# EAGLE design temp_sensor_rev1 (EAGLE 6.5.0)
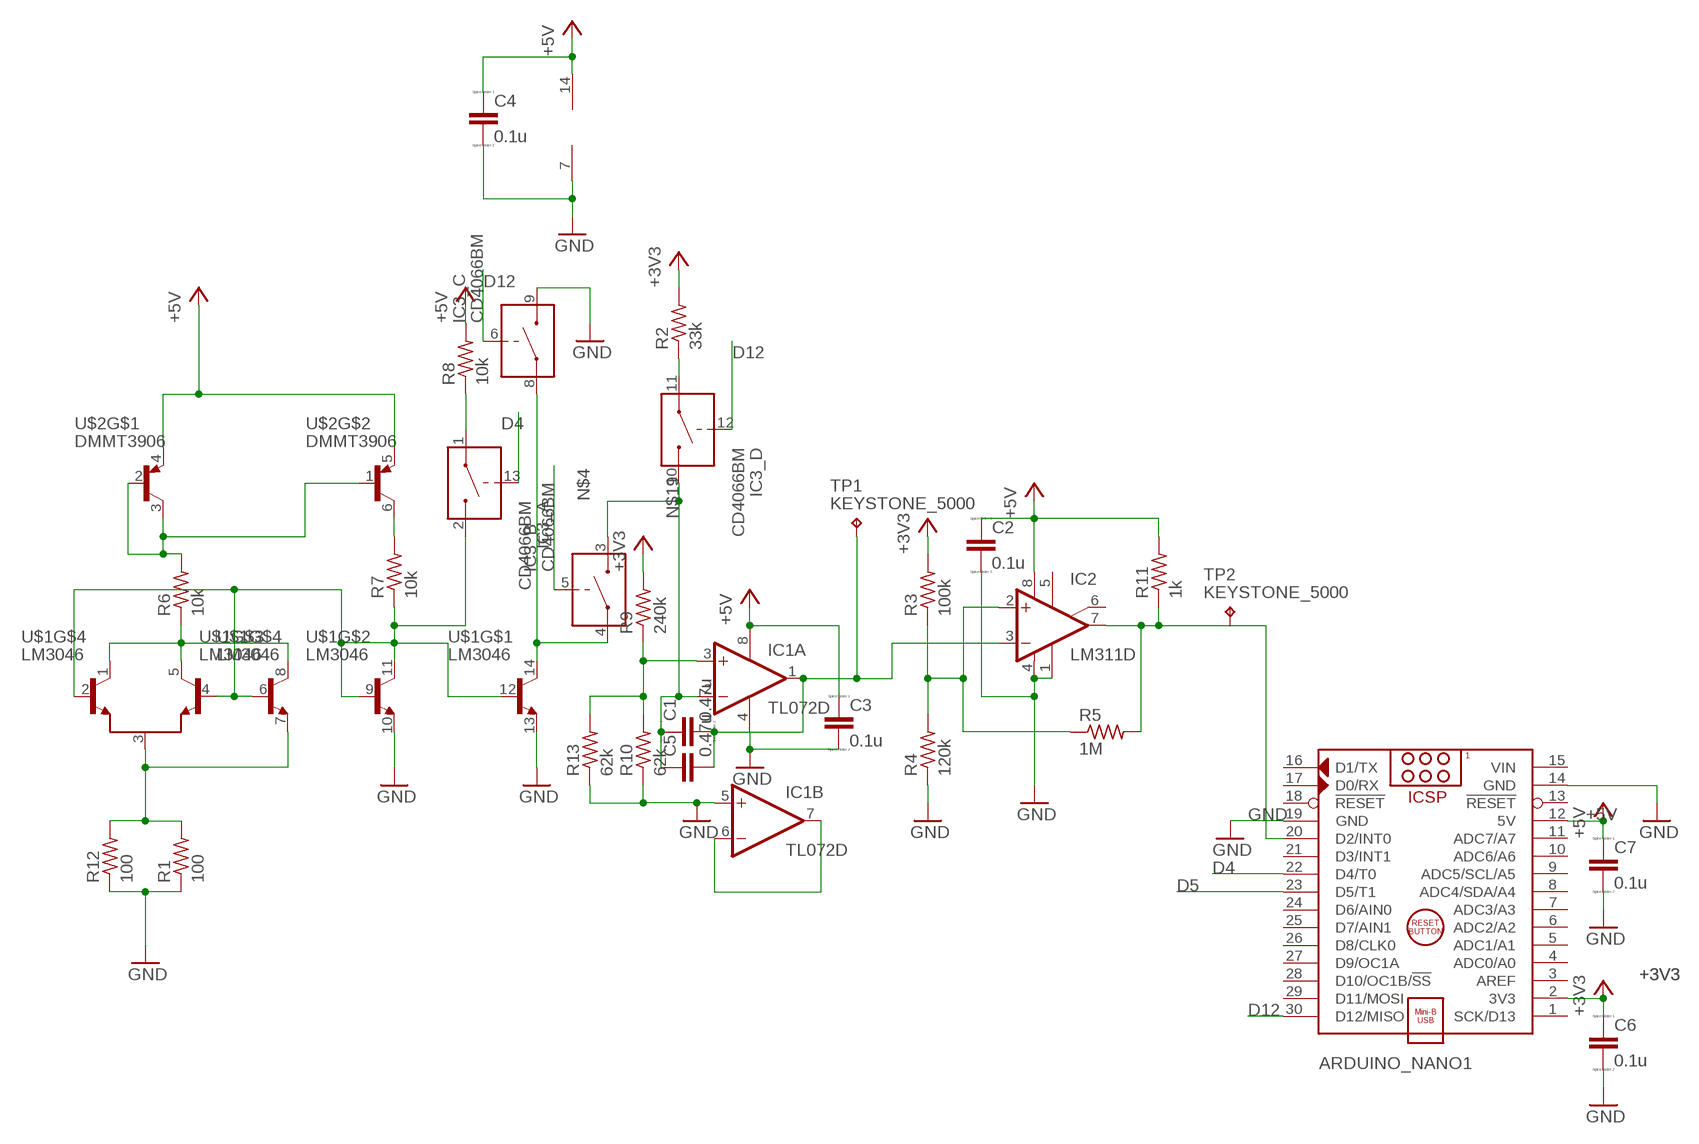
[diagram p0: schematic, sheet 1]

## Parts
ARDUINO_NANO1  ARDUINO_NANO  [ARDUINO_NANO]
C1  0.47u  CC1206  [C1206]
C2  0.1u  C  [C0805]
C3  0.1u  C  [C0805]
C4  0.1u  C  [C0805]
C5  0.47u  C2.5/2  [C2.5-2]
C6  0.1u  C  [C0805]
C7  0.1u  C  [C0805]
IC1  TL072D  [SO08]
IC2  LM311D  [SO08]
IC3  CD4066BM  [SO14]
R1  100  R-US_M1206  [M1206]
R2  33k  R-US_M1206  [M1206]
R3  100k  R-US_M1206  [M1206]
R4  120k  R-US_M1206  [M1206]
R5  1M  R-US_M1206  [M1206]
R6  10k  R-US_M1206  [M1206]
R7  10k  R-US_M1206  [M1206]
R8  10k  R-US_M1206  [M1206]
R9  240k  R-US_M1206  [M1206]
R10  62k  R-US_M1206  [M1206]
R11  1k  R-US_M1206  [M1206]
R12  100  R-US_0207/7  [0207/7]
R13  62k  R-US_0207/7  [0207/7]
TP1  KEYSTONE_5000  TESTPOINT  [KEYSTONE_5000_MINIATURE]
TP2  KEYSTONE_5000  TESTPOINT  [KEYSTONE_5000_MINIATURE]
U$1  LM3046  [SO14]
U$2  DMMT3906  [SOT363_PHILIPS]

## Nets
+3V3: ARDUINO_NANO1.2(3V3) C6.1 R2.2 R3.2 R9.2
+5V: ARDUINO_NANO1.12(5V) C2.1 C3.1 C4.1 C7.1 IC1.8(P:V+) IC2.8(V+) IC3.14(V+) R8.2 R11.2 U$2.4(E) U$2.5(E)
D4: ARDUINO_NANO1.22(D4/T0) IC3.13(_A:CONTROL)
D5: ARDUINO_NANO1.23(D5/T1) IC3.5(_B:CONTROL)
D12: ARDUINO_NANO1.30(D12/MISO) IC3.6(_C:CONTROL) IC3.12(_D:CONTROL)
GND: ARDUINO_NANO1.14(GND) ARDUINO_NANO1.19(GND) C2.2 C3.2 C4.2 C6.2 C7.2 IC1.4(P:V-) IC1.5(B:+IN) IC2.1(GND) IC2.4(V-) IC3.7(V-) IC3.9(_C:IN/OUT2) R1.1 R4.1 R10.1 R12.1 R13.1 U$1.10(E) U$1.13(E)
N$1: IC1.6(B:-IN) IC1.7(B:OUT)
N$2: R1.2 R12.2 U$1.3(E) U$1.7(E)
N$4: IC3.4(_B:IN/OUT1) IC3.8(_C:IN/OUT1) U$1.14(C)
N$5: ARDUINO_NANO1.20(D2/INT0) IC2.7(OUT) R5.2 R11.1 TP2.P$1
N$6: IC2.2(+IN) R3.1 R4.2 R5.1
N$7: R6.1 U$1.1(C) U$1.5(CR) U$1.8(C)
N$8: R6.2 U$2.1(B) U$2.2(B) U$2.3(C)
N$10: R7.2 U$2.6(C)
N$11: IC3.2(_A:IN/OUT2) R7.1 U$1.2(B) U$1.4(BR) U$1.6(B) U$1.9(B) U$1.11(C) U$1.12(B)
N$15: IC3.1(_A:IN/OUT1) R8.1
N$16: IC1.3(A:+IN) R9.1 R10.2 R13.2
N$17: IC3.11(_D:IN/OUT1) R2.1
N$19: C1.1 C5.1 IC1.2(A:-IN) IC3.3(_B:IN/OUT2) IC3.10(_D:IN/OUT2)
N$22: C1.2 C5.2 IC1.1(A:OUT) IC2.3(-IN) TP1.P$1
Unconnected: ARDUINO_NANO1.1(SCK/D13) ARDUINO_NANO1.3(AREF) ARDUINO_NANO1.4(ADC0/A0) ARDUINO_NANO1.5(ADC1/A1) ARDUINO_NANO1.6(ADC2/A2) ARDUINO_NANO1.7(ADC3/A3) ARDUINO_NANO1.8(ADC4/SDA/A4) ARDUINO_NANO1.9(ADC5/SCL/A5) ARDUINO_NANO1.10(ADC6/A6) ARDUINO_NANO1.11(ADC7/A7) ARDUINO_NANO1.13(!RESET) ARDUINO_NANO1.16(D1/TX) ARDUINO_NANO1.17(D0/RX) ARDUINO_NANO1.18(!RESET) ARDUINO_NANO1.21(D3/INT1) ARDUINO_NANO1.24(D6/AIN0) ARDUINO_NANO1.25(D7/AIN1) ARDUINO_NANO1.26(D8/CLK0) ARDUINO_NANO1.27(D9/OC1A) ARDUINO_NANO1.28(D10/OC1B/!SS) ARDUINO_NANO1.29(D11/MOSI) IC2.5(ON) IC2.6(ON/STR)

## Power pins joined to a net without a drawn wire
VIN: ARDUINO_NANO1.15(VIN)

## Library data of the parts
ARDUINO_NANO1 = 6301-temp-sensor-rev1:ARDUINO_NANO: Arduino Nano V3.0 Module Overview: The Arduino Nano is a small, complete, and breadboard-friendly board based on the ATmega328 (Arduino Nano 3.x) or ATmega168 (Arduino Nano 2.x). It has more or less the same functionality of the Arduino Duemilanove, but in a different package. It lacks only a DC power jack, and works with a Mini-B USB cable instead of a standard one. The Nano was designed and is being produced by Gravitech <http://www.gravitech.us/arna30wiatp.html>. General specifications: Item Value Microcontroller Atmel ATmega168 or ATmega328 Operating Voltage (logic level) 5 V Input Voltage (recommended) 7-12 V Input Voltage (limits) 6-20 V Digital I/O Pins 14 (of which 6 provide PWM output) Analog Input Pins 8 DC Current per I/O Pin 40 mA Flash Memory 16 KB (ATmega168) or 32 KB (ATmega328) of which 2 KB used by bootloader SRAM 1 KB (ATmega168) or 2 KB (ATmega328) EEPROM 512 bytes (ATmega168) or 1 KB (ATmega328) Clock Speed 16 MHz Dimensions (Inches) 0.73" x 1.70" Dimensions (mm) 18mm x 45mm Overall height About 9 mm (not including pins) Weigth 5 g Power: The Arduino Nano can be powered via the Mini-B USB connection, 6-20V unregulated external power supply (pin 30), or 5V regulated external power supply (pin 27). The power source is automatically selected to the highest voltage source. Memory: The ATmega168 has 16 KB of flash memory for storing code (of which 2 KB is used for the bootloader); the ATmega328 has 32 KB, (also with 2 KB used for the bootloader). The ATmega168 has 1 KB of SRAM and 512 bytes of EEPROM (which can be read and written with the EEPROM library); the ATmega328 has 2 KB of SRAM and 1 KB of EEPROM. Input and Output: Each of the 14 digital pins on the Nano can be used as an input or output, using pinMode(), digitalWrite(), and digitalRead() functions. They operate at 5 volts. Each pin can provide or receive a maximum of 40 mA and has an internal pull-up resistor (disconnected by default) of 20-50 kOhms. In addition, some pins have specialized functions. Visit Arduino - ArduinoBoardNano <https://www.arduino.cc/en/Main/ArduinoBoardNano>
C1-C4 C6 C7 = eagle-ltspice:C: CAPACITOR, European symbol; SPICEMODEL: NONE; SPICEPREFIX: C
C5 = capacitor-wima:C: CAPACITOR naming: grid - package width
IC1 = 6301-temp-sensor-rev1:TL072: OP AMP
IC2 = 6301-temp-sensor-rev1:LM311: COMPARATOR
IC3 = 6301-temp-sensor-rev1:CD4066B
R1-R13 = tutorial:R-US_: RESISTOR, American symbol
TP1 TP2 = 6301-temp-sensor-rev1:TESTPOINT
U$1 = 6301-temp-sensor-rev1:LM3046
U$2 = 6301-temp-sensor-rev1:DMMT3906

## Board
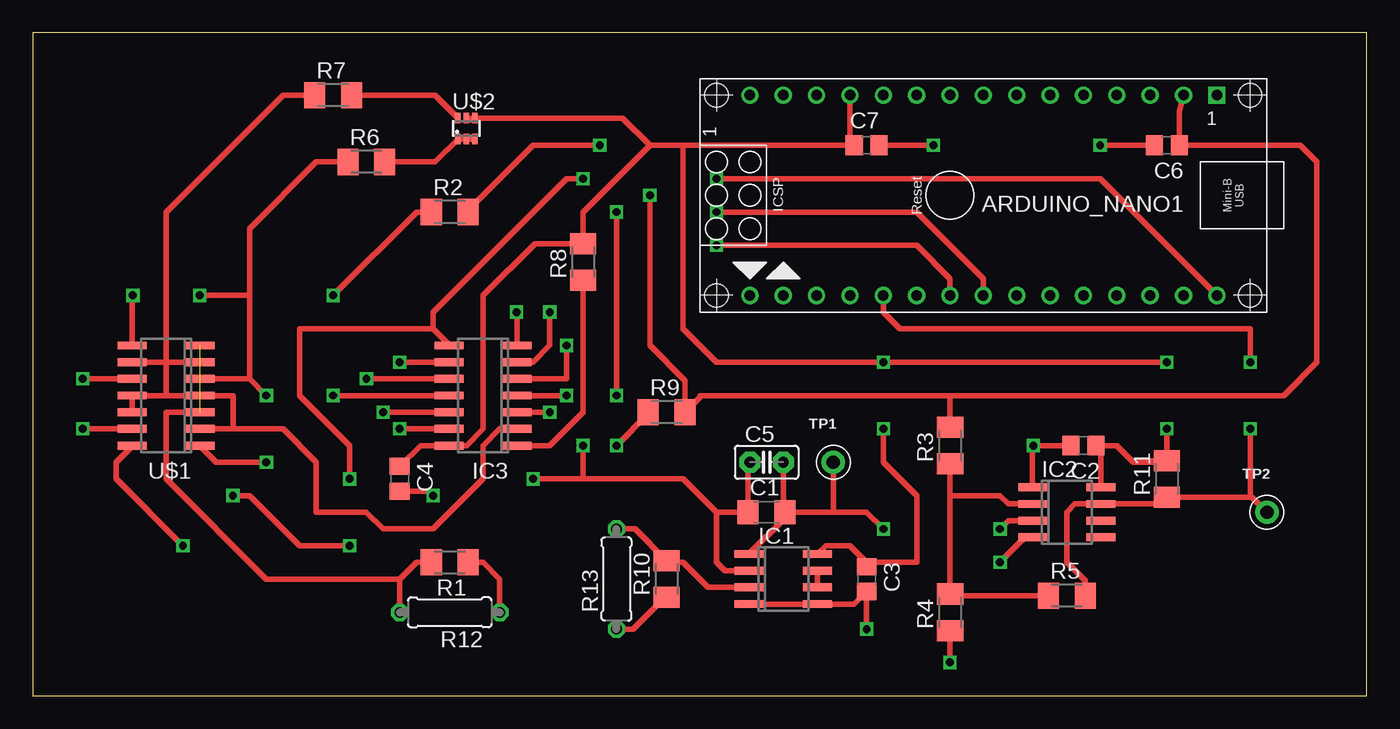
[diagram p1: board, top side]
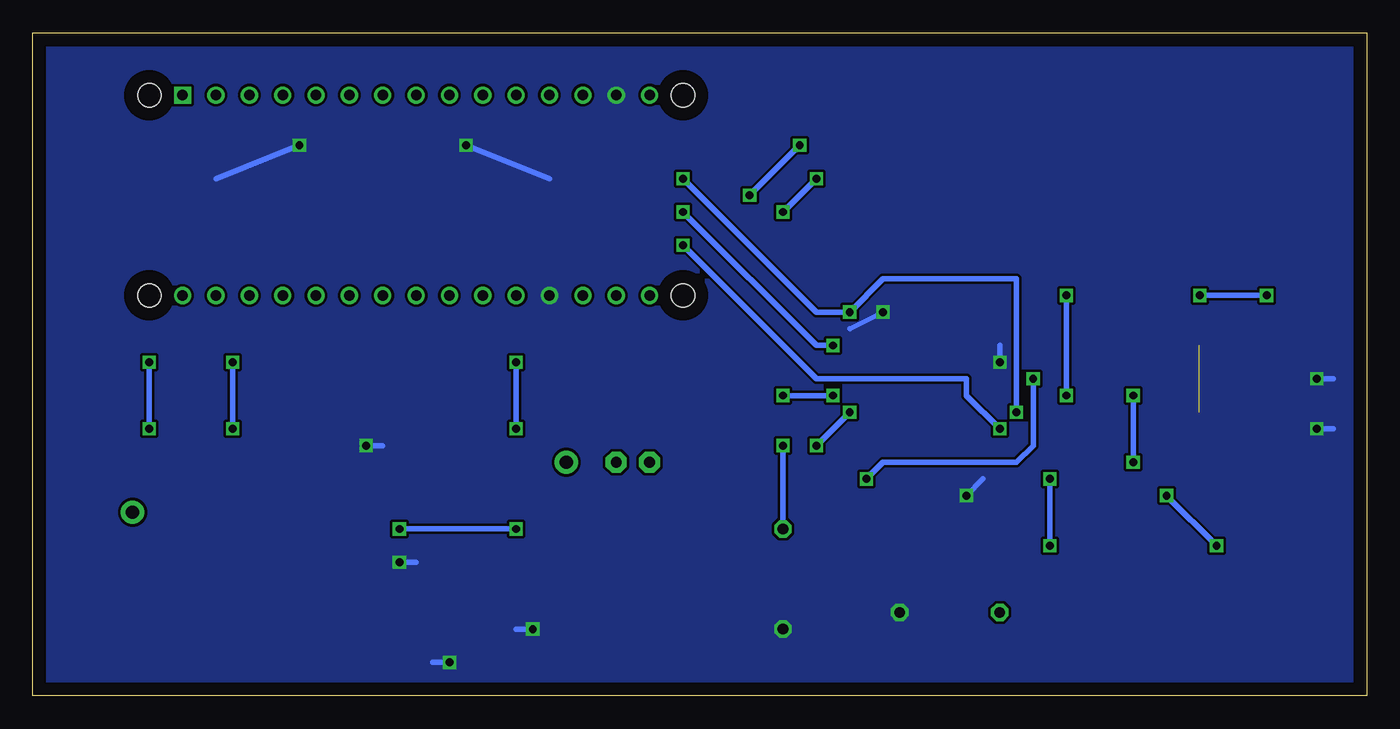
[diagram p2: board, bottom side, seen from below]

Size 101.58 x 50.47 mm. Coordinates in mm from the lower left corner, seen from the top.
Outline: 0,0 101.58,0 101.58,50.47 0,50.47 0,0
Copper layers (1*16): Top 0.035mm / dielectric 1.5mm / Bottom 0.035mm
Design rules "default": minimum track width 10mil, minimum drill 24mil, track to track 8mil, track to pad 8mil, pad to pad 8mil, via to via 8mil, smd to smd 8mil, copper to edge 40mil, drill to drill 8mil, minimum pad ring 10mil, minimum via ring 8mil, stop-mask expansion 4mil, vias tented up to drill 0mil, thermal gap 10mil

### Footprints (pad centres in the part's own frame; a part is rotated, then mirrored left to right if it is on the bottom)
ARDUINO_NANO = drill 0.8 square: 1 -20.32,-7.62 | drill 0.8: 2 -17.78,-7.62; 3 -15.24,-7.62; 4 -12.7,-7.62; 5 -10.16,-7.62; 6 -7.62,-7.62; 7 -5.08,-7.62; 8 -2.54,-7.62; 9 0,-7.62; 10 2.54,-7.62; 11 5.08,-7.62; 12 7.62,-7.62; 13 10.16,-7.62; 14 12.7,-7.62; 15 15.24,-7.62; 16 15.24,7.62; 17 12.7,7.62; 18 10.16,7.62; 19 7.62,7.62; 20 5.08,7.62; 21 2.54,7.62; 22 0,7.62; 23 -2.54,7.62; 24 -5.08,7.62; 25 -7.62,7.62; 26 -10.16,7.62; 27 -12.7,7.62; 28 -15.24,7.62; 29 -17.78,7.62; 30 -20.32,7.62 | hole 1.778: -22.86,-7.62; -22.86,7.62; 17.78,7.62; 17.78,-7.62
C1206 = smd 1.6 x 1.8: 1 -1.4,0; 2 1.4,0
C0805 = smd 1.3 x 1.5: 1 -0.95,0; 2 0.95,0
C2.5-2 = drill 0.813 pad 1.6 octagon: 1 -1.27,0; 2 1.27,0
SO08 = smd 0.6 x 2.2: 1 -1.905,-2.6; 2 -0.635,-2.6; 3 0.635,-2.6; 4 1.905,-2.6; 5 1.905,2.6; 6 0.635,2.6; 7 -0.635,2.6; 8 -1.905,2.6
SO14 = smd 0.6 x 2.2: 1 -3.81,-2.6; 2 -2.54,-2.6; 3 -1.27,-2.6; 4 0,-2.6; 5 1.27,-2.6; 6 2.54,-2.6; 7 3.81,-2.6; 8 3.81,2.6; 9 2.54,2.6; 10 1.27,2.6; 11 0,2.6; 12 -1.27,2.6; 13 -2.54,2.6; 14 -3.81,2.6
M1206 = smd 1.6 x 2: 1 -1.4,0; 2 1.4,0
0207/7 = drill 0.813 octagon: 1 -3.81,0; 2 3.81,0
KEYSTONE_5000_MINIATURE = drill 1.016 pad 1.778: P$1 0,0
SOT363_PHILIPS = smd 0.4 x 0.8: 1 -0.65,-0.8; 2 0,-0.8; 3 0.65,-0.8; 4 0.65,0.8; 5 0,0.8; 6 -0.65,0.8

### Placement (x,y rotation side)
ARDUINO_NANO1  69.85,38.1 180 top
C1  55.88,13.97 0 top
C2  80.01,19.05 180 top
C3  63.5,8.89 270 top
C4  27.94,16.51 270 top
C5  55.88,17.78 0 top
C6  86.36,41.91 180 top
C7  63.5,41.91 0 top
IC1  57.15,8.89 270 top
IC2  78.74,13.97 270 top
IC3  34.29,22.86 90 top
R1  31.75,10.16 180 top
R2  31.75,36.83 0 top
R3  69.85,19.05 90 top
R4  69.85,6.35 90 top
R5  78.74,7.62 0 top
R6  25.4,40.64 0 top
R7  22.86,45.72 0 top
R8  41.91,33.02 90 top
R9  48.26,21.59 0 top
R10  48.26,8.89 90 top
R11  86.36,16.51 90 top
R12  31.75,6.35 180 top
R13  44.45,8.89 90 top
TP1  60.96,17.78 0 top
TP2  93.98,13.97 0 top
U$1  10.16,22.86 90 top
U$2  33.02,43.18 0 top

### Tracks (layer width: path | path; a pad name or v marks a point on that pad's centre or on a via)
+3V3  (via drill 0.6)
  Top 0.406: ARDUINO_NANO1.2 87.31,44.45 C6.1 96.52,41.91 97.79,40.64 97.79,25.4 95.25,22.86 69.85,22.86 | R3.2 69.85,22.86 | 69.85,22.86 50.8,22.86 50.8,22.73 R9.2 49.66,24 46.99,26.67 v46.99,38.1 | R2.2 33.15,36.96 38.1,41.91 v43.18,41.91
  Bottom 0.406: v46.99,38.1 v43.18,41.91
+5V  (via drill 0.6)
  Top 0.406: ARDUINO_NANO1.12 62.23,42.23 C7.1 49.53,41.91 | 49.53,41.91 46.99,41.91 | C3.1 63.5,10.16 | IC1.8 60.38,11.43 62.23,11.43 63.5,10.16 | U$2.5 U$2.4 44.92,43.98 46.99,41.91 | R11.2 83.69,17.91 | 83.69,17.91 82.55,19.05 81.28,19.05 | 81.28,19.05 C2.1 81.34,18.67 IC2.8 81.34,18.99 81.28,19.05 | 63.5,10.16 67.31,10.16 67.31,15.24 64.77,17.78 v64.77,20.32 | 83.69,17.91 83.82,17.78 86.36,17.78 v86.36,20.32 | v86.36,25.4 v64.77,25.4 52.07,25.4 49.53,27.94 49.53,41.91 | C4.1 29.53,19.05 IC3.14 33.02,19.05 34.29,20.32 34.29,30.48 38.23,34.42 R8.2 41.91,36.83 46.99,41.91
  Bottom 0.406: v64.77,20.32 v64.77,25.4 | v86.36,20.32 v86.36,25.4
D4  (via drill 0.6)
  Top 0.406: ARDUINO_NANO1.22 69.85,31.75 67.31,34.29 v52.07,34.29 | v27.94,20.32 IC3.13
  Bottom 0.406: v52.07,34.29 41.91,24.13 30.48,24.13 30.48,22.86 v27.94,20.32
D5  (via drill 0.6)
  Top 0.406: ARDUINO_NANO1.23 72.39,31.75 67.31,36.83 v52.07,36.83 | v40.64,26.67 40.64,24.13 IC3.5
  Bottom 0.406: v40.64,26.67 41.91,26.67 v52.07,36.83
D12  (via drill 0.6)
  Top 0.406: ARDUINO_NANO1.30 81.28,39.37 v52.07,39.37 | v39.37,29.21 39.37,26.67 38.1,25.4 IC3.6 | IC3.12 v26.67,21.59
  Bottom 0.406: v52.07,39.37 41.91,29.21 v39.37,29.21 36.83,31.75 26.67,31.75 v26.67,21.59
GND  (via drill 0.6)
  Top 0.406: C7.2 v68.58,41.91 | C6.2 v81.28,41.91 | U$1.10 v3.81,24.13 | U$1.13 v3.81,20.32 | C4.2 30.16,15.56 v30.48,15.24 | R10.1 48.13,7.49 45.72,5.08 R13.1 | R1.1 34.29,10.16 35.56,8.89 R12.1 | IC3.9 v27.94,25.4 | IC1.4 IC1.5 62.55,6.99 C3.2 v63.5,5.08 | R4.1 v69.85,2.54 | IC2.4 75.56,12.06 v73.66,10.16 | C2.2 v76.2,19.05 76.14,18.99 IC2.1 | IC3.7 36.89,29.15 v36.83,29.21
  Bottom 0.406: v68.58,41.91 62.23,39.37 | v81.28,41.91 87.63,39.37 | v3.81,24.13 2.54,24.13 | v3.81,20.32 2.54,20.32 | v30.48,15.24 29.21,16.51 | v63.5,5.08 64.77,5.08 | v69.85,2.54 71.12,2.54 | v73.66,10.16 72.39,10.16 | v76.2,19.05 74.93,19.05 | v36.83,29.21 39.37,27.94 | v27.94,25.4 27.94,26.67
  pour Bottom (no thermals): 101.6,0 101.6,49.53 0,49.53 0,0
N$1
  Top 0.406: IC1.7 IC1.6
N$2  (1 unrouted)
  Top 0.406: 27.94,8.89 R12.2 | 27.94,8.89 17.78,8.89 10.16,16.51 10.16,21.59 U$1.3 | R1.2 29.21,10.16 27.94,8.89
N$4  (via drill 0.6)
  Top 0.406: U$1.14 7.56,18.99 6.35,17.78 6.35,16.51 v11.43,11.43 | v15.24,15.24 16.51,15.24 20.32,11.43 v24.13,11.43 | IC3.8 31.69,26.73 30.48,27.94 | 30.48,27.94 20.32,27.94 20.32,22.86 24.13,19.05 v24.13,16.51 | IC3.4 v40.64,22.86 | v44.45,22.86 v44.45,36.83 | v41.91,39.37 40.64,39.37 30.48,29.21 30.48,27.94
  Bottom 0.406: v11.43,11.43 v15.24,15.24 | v24.13,11.43 v24.13,16.51 | v40.64,22.86 v44.45,22.86 | v44.45,36.83 v41.91,39.37
N$5  (via drill 0.6)
  Top 0.406: R5.2 80.14,8.76 78.74,10.16 78.74,13.97 79.38,14.61 IC2.7 85.86,14.61 R11.1 92.71,15.11 | 92.71,15.11 92.84,15.11 TP2.P$1 | ARDUINO_NANO1.20 64.77,29.21 66.04,27.94 92.71,27.94 v92.71,25.4 | v92.71,20.32 92.71,15.11
  Bottom 0.406: v92.71,25.4 v92.71,20.32
N$6
  Top 0.406: R5.1 69.98,7.62 R4.2 69.85,15.24 | R3.1 69.85,15.24 | IC2.2 74.3,14.61 73.66,15.24 69.85,15.24
N$7  (via drill 0.6)
  Top 0.406: U$1.5 16.51,24.13 | 16.51,24.13 16.51,30.48 | 16.51,30.48 16.51,35.56 21.59,40.64 R6.1 | U$1.1 12.76,18.99 13.97,17.78 v17.78,17.78 | v17.78,22.86 16.51,24.13 | U$1.8 7.56,30.42 v7.62,30.48 | v12.7,30.48 16.51,30.48
  Bottom 0.406: v17.78,17.78 v17.78,22.86 | v7.62,30.48 v12.7,30.48
N$8
  Top 0.406: R6.2 30.63,40.64 U$2.1 U$2.2 U$2.3
N$10
  Top 0.406: R7.2 30.63,45.72 U$2.6
N$11
  Top 0.406: 15.24,20.32 U$1.2 | R7.1 19.05,45.72 10.16,36.83 10.16,25.4 | 10.16,25.4 U$1.6 | U$1.9 10.16,25.4 | 10.16,25.4 10.16,22.86 | 10.16,22.86 U$1.11 U$1.12 | 10.16,22.86 U$1.4 15.24,22.86 15.24,20.32 | 15.24,20.32 19.05,20.32 21.59,17.78 21.59,13.97 25.4,13.97 26.67,12.7 30.48,12.7 34.29,16.51 34.29,19.05 35.56,20.32 IC3.2
N$15
  Top 0.406: R8.1 41.91,21.59 39.37,19.05 IC3.1
N$16  (via drill 0.6)
  Top 0.406: 44.32,19.18 v44.45,19.05 46.86,21.46 R9.1 | R13.2 45.85,12.7 R10.2 48.39,10.16 49.53,10.16 51.44,8.26 IC1.3
  Bottom 0.406: v44.45,19.05 R13.2
N$17  (via drill 0.6)
  Top 0.406: v22.86,22.86 IC3.11 | v22.86,30.48 29.21,36.83 R2.1
  Bottom 0.406: v22.86,30.48 v22.86,22.86
N$19  (via drill 0.6)
  Top 0.406: IC1.2 52.7,9.53 52.07,10.16 52.07,13.97 | 52.07,13.97 C1.1 54.48,17.65 C5.1 | 41.91,16.51 49.53,16.51 52.07,13.97 | IC3.3 v39.37,21.59 | v41.91,19.05 41.91,16.51 | 41.91,16.51 v38.1,16.51 | v25.4,24.13 IC3.10
  Bottom 0.406: v39.37,21.59 v41.91,19.05 | v38.1,16.51 36.83,17.78 26.67,17.78 25.4,19.05 v25.4,24.13
N$22  (via drill 0.6)
  Top 0.406: C5.2 57.15,14.1 C1.2 | C1.2 57.28,13.53 IC1.1 | TP1.P$1 60.96,13.97 | 60.96,13.97 C1.2 | 60.96,13.97 63.5,13.97 v64.77,12.7 | IC2.3 74.3,13.34 v73.66,12.7
  Bottom 0.406: v64.77,12.7 v73.66,12.7